# EasyEDA schematic SCH_DHT22_TEMP_SENSOR_2024-02-15.json
TITLE: Sheet_1; REV: 1.0; Date: 2024-02-15; Sheet: 1/1; Drawn By: mubashirlio; Company: Your Company
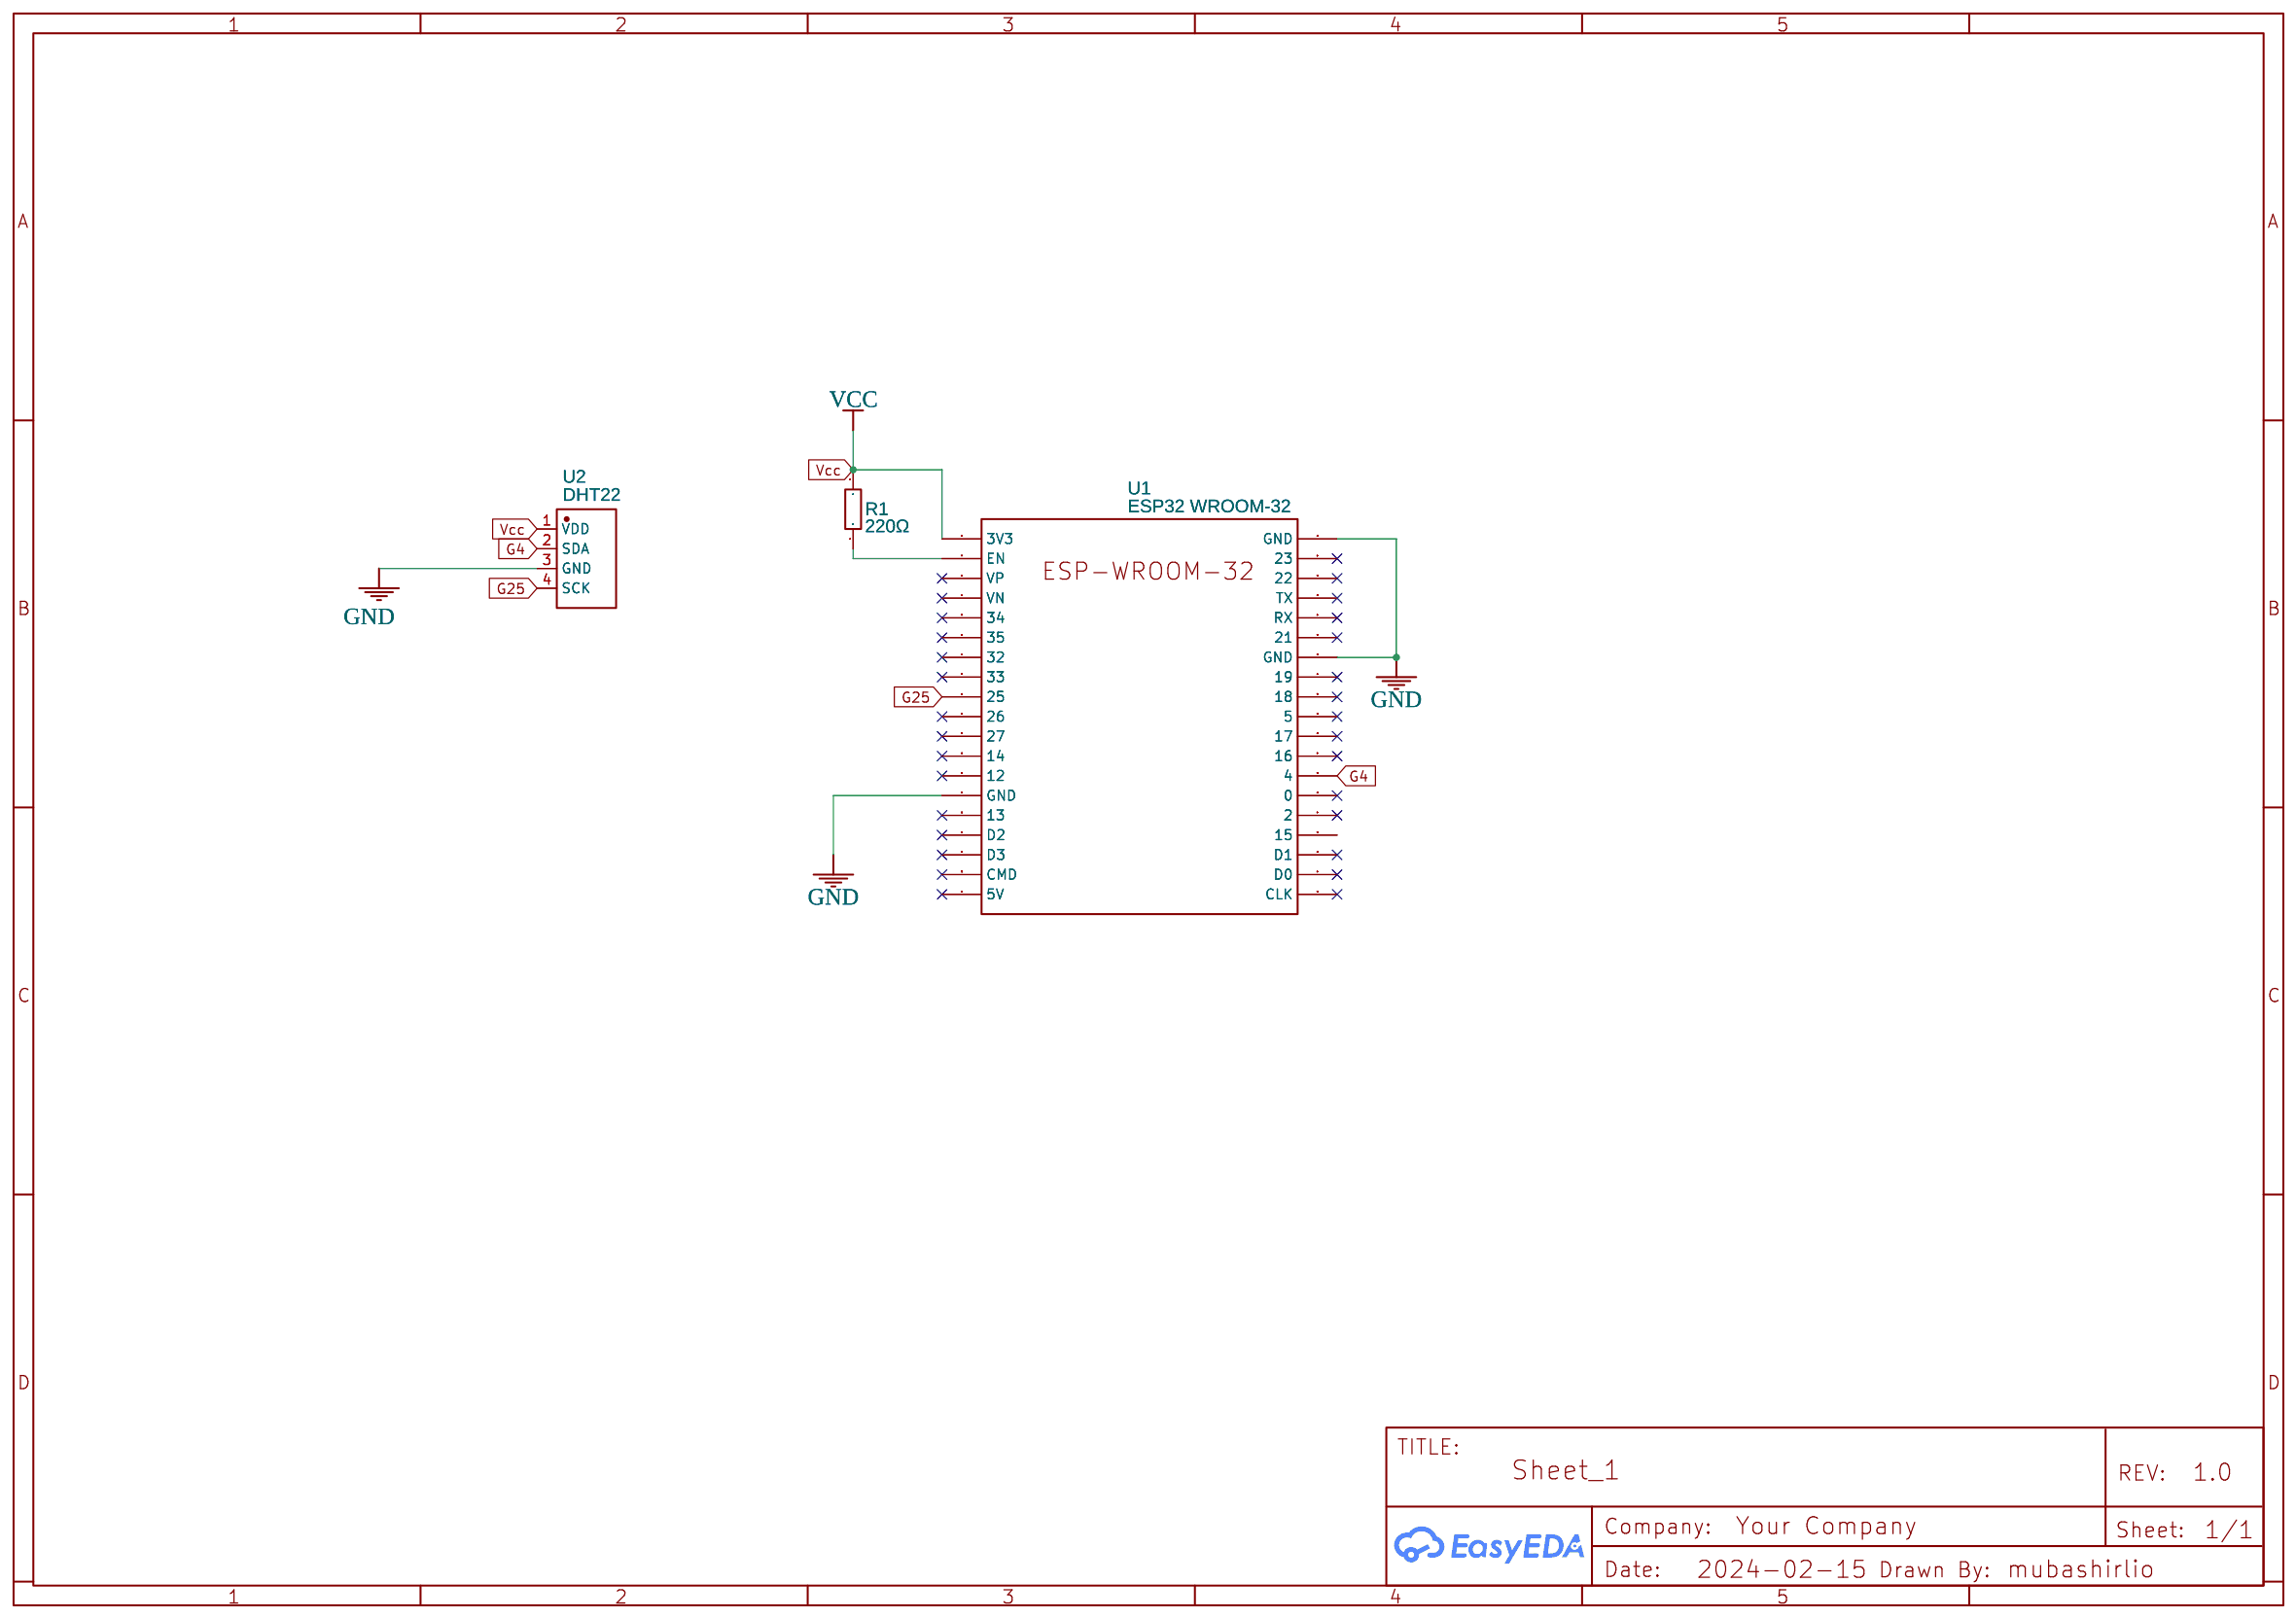
[diagram p0: schematic sheet]

## Parts
R1  220Ω  [R0805]
U1  ESP32 WROOM-32  [ESP32 WROOM-32]
U2  DHT22  [SENSOR-TH_HAIGU_DHT22]

## Library data of the parts
R1 = RT0805DRD07220RL: Contributor: LCSC; Supplier: LCSC; Supplier Part: C327039; Manufacturer: YAGEO(国巨); JLCPCB Part Class: Extended Part
U1 = ESP32 WROOM-32: Supplier: LCSC; Contributor: mubashirlio
U2 = DHT22: Contributor: LCSC; Supplier: LCSC; Supplier Part: C2880291; Manufacturer: HAIGU(广州海谷); JLCPCB Part Class: Extended Part

## Nets
GND: U1.14(GND) U1.32(GND) U1.38(GND) U2.3(GND)
VCC: R1.2 U1.1(3V3) U2.1(VDD)
G4: U1.26(4) U2.2(SDA)
G25: U1.9(25) U2.4(SCK)
Net-(R1-1): R1.1 U1.2(EN)

Not connected (* = marked no-connect by the designer): U1 3(VP)* 4(VN)* 5(34)* 6(35)* 7(32)* 8(33)* 10(26)* 11(27)* 12(14)* 13(12)* 15(13)* 16(D2)* 17(D3)* 18(CMD)* 19(5V)* 20(CLK)* 21(D0)* 22(D1)* 23(15) 24(2)* 25(0)* 27(16)* 28(17)* 29(5)* 30(18)* 31(19)* 33(21)* 34(RX)* 35(TX)* 36(22)* 37(23)*
